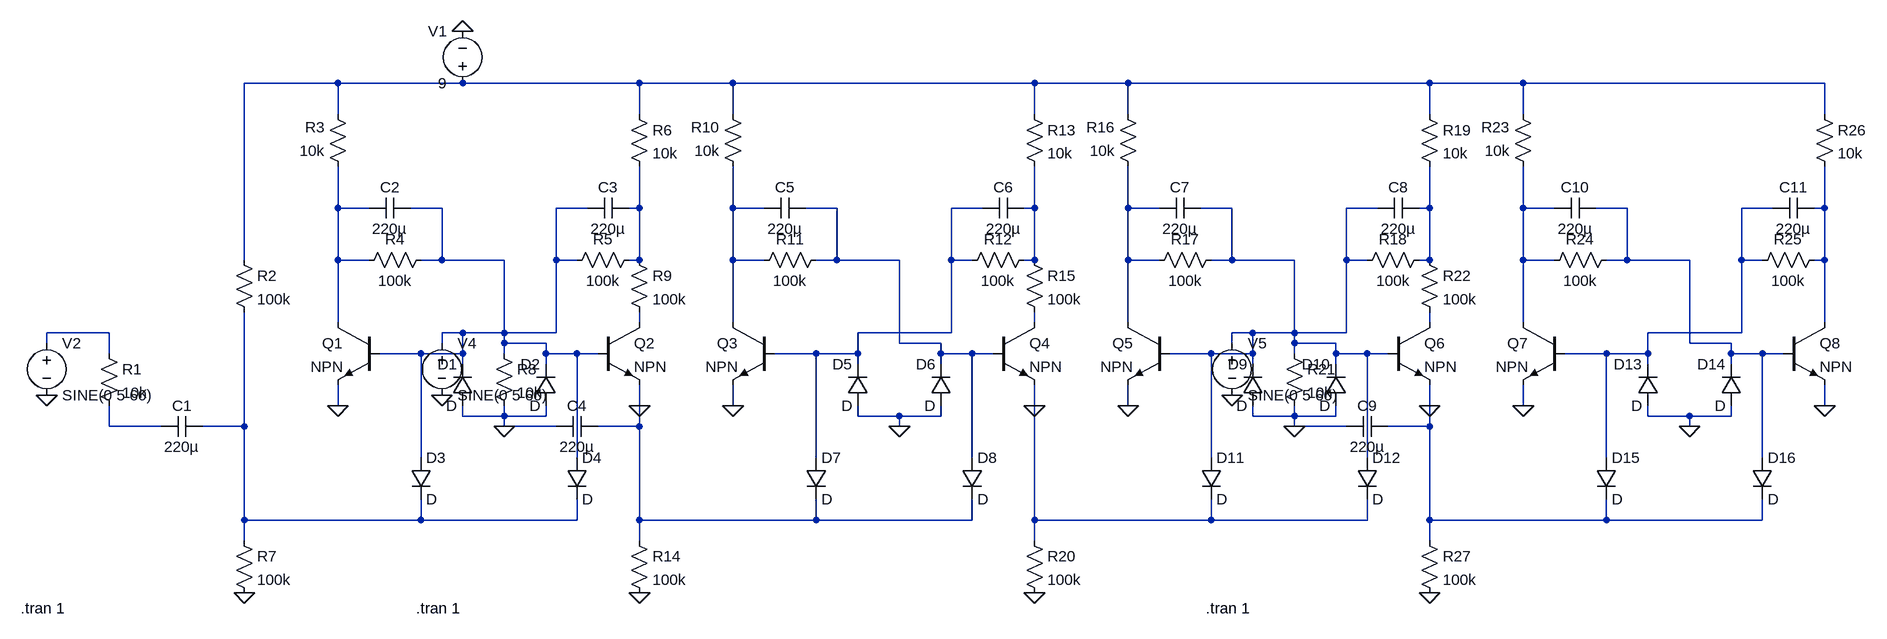
[diagram p0: schematic impedance converter amplifier.asc]
impedance converter amplifier.asc, the LTspice schematic file:
Version 4.1
SHEET 1 2868 680
WIRE 512 -384 368 -384
WIRE 704 -384 512 -384
WIRE 976 -384 704 -384
WIRE 1120 -384 976 -384
WIRE 1584 -384 1120 -384
WIRE 1728 -384 1584 -384
WIRE 2192 -384 1728 -384
WIRE 2336 -384 2192 -384
WIRE 2800 -384 2336 -384
WIRE 512 -336 512 -384
WIRE 976 -336 976 -384
WIRE 1120 -336 1120 -384
WIRE 1584 -336 1584 -384
WIRE 1728 -336 1728 -384
WIRE 2192 -336 2192 -384
WIRE 2336 -336 2336 -384
WIRE 2800 -336 2800 -384
WIRE 512 -192 512 -256
WIRE 560 -192 512 -192
WIRE 672 -192 624 -192
WIRE 896 -192 848 -192
WIRE 976 -192 976 -256
WIRE 976 -192 960 -192
WIRE 1120 -192 1120 -256
WIRE 1168 -192 1120 -192
WIRE 1280 -192 1232 -192
WIRE 1504 -192 1456 -192
WIRE 1584 -192 1584 -256
WIRE 1584 -192 1568 -192
WIRE 1728 -192 1728 -256
WIRE 1776 -192 1728 -192
WIRE 1888 -192 1840 -192
WIRE 2112 -192 2064 -192
WIRE 2192 -192 2192 -256
WIRE 2192 -192 2176 -192
WIRE 2336 -192 2336 -256
WIRE 2384 -192 2336 -192
WIRE 2496 -192 2448 -192
WIRE 2720 -192 2672 -192
WIRE 2800 -192 2800 -256
WIRE 2800 -192 2784 -192
WIRE 368 -112 368 -384
WIRE 512 -112 512 -192
WIRE 560 -112 512 -112
WIRE 672 -112 672 -192
WIRE 672 -112 640 -112
WIRE 768 -112 672 -112
WIRE 848 -112 848 -192
WIRE 880 -112 848 -112
WIRE 976 -112 976 -192
WIRE 976 -112 960 -112
WIRE 1120 -112 1120 -192
WIRE 1168 -112 1120 -112
WIRE 1280 -112 1280 -192
WIRE 1280 -112 1248 -112
WIRE 1376 -112 1280 -112
WIRE 1456 -112 1456 -192
WIRE 1488 -112 1456 -112
WIRE 1584 -112 1584 -192
WIRE 1584 -112 1568 -112
WIRE 1728 -112 1728 -192
WIRE 1776 -112 1728 -112
WIRE 1888 -112 1888 -192
WIRE 1888 -112 1856 -112
WIRE 1984 -112 1888 -112
WIRE 2064 -112 2064 -192
WIRE 2096 -112 2064 -112
WIRE 2192 -112 2192 -192
WIRE 2192 -112 2176 -112
WIRE 2336 -112 2336 -192
WIRE 2384 -112 2336 -112
WIRE 2496 -112 2496 -192
WIRE 2496 -112 2464 -112
WIRE 2592 -112 2496 -112
WIRE 2672 -112 2672 -192
WIRE 2704 -112 2672 -112
WIRE 2800 -112 2800 -192
WIRE 2800 -112 2784 -112
WIRE 512 -16 512 -112
WIRE 976 -16 976 -32
WIRE 1120 -16 1120 -112
WIRE 1584 -16 1584 -32
WIRE 1728 -16 1728 -112
WIRE 2192 -16 2192 -32
WIRE 2336 -16 2336 -112
WIRE 2800 -16 2800 -112
WIRE 160 0 64 0
WIRE 704 0 672 0
WIRE 768 0 768 -112
WIRE 768 0 704 0
WIRE 848 0 848 -112
WIRE 848 0 768 0
WIRE 1456 0 1456 -112
WIRE 1456 0 1312 0
WIRE 1920 0 1888 0
WIRE 1984 0 1984 -112
WIRE 1984 0 1920 0
WIRE 2064 0 2064 -112
WIRE 2064 0 1984 0
WIRE 2672 0 2672 -112
WIRE 2672 0 2528 0
WIRE 64 16 64 0
WIRE 672 16 672 0
WIRE 768 16 768 0
WIRE 832 16 768 16
WIRE 1376 16 1376 -112
WIRE 1440 16 1376 16
WIRE 1888 16 1888 0
WIRE 1984 16 1984 0
WIRE 2048 16 1984 16
WIRE 2592 16 2592 -112
WIRE 2656 16 2592 16
WIRE 160 32 160 0
WIRE 640 32 576 32
WIRE 704 32 704 0
WIRE 704 32 640 32
WIRE 768 32 768 16
WIRE 832 32 832 16
WIRE 880 32 832 32
WIRE 912 32 880 32
WIRE 1248 32 1184 32
WIRE 1312 32 1312 0
WIRE 1312 32 1248 32
WIRE 1440 32 1440 16
WIRE 1488 32 1440 32
WIRE 1520 32 1488 32
WIRE 1856 32 1792 32
WIRE 1920 32 1920 0
WIRE 1920 32 1856 32
WIRE 1984 32 1984 16
WIRE 2048 32 2048 16
WIRE 2096 32 2048 32
WIRE 2128 32 2096 32
WIRE 2464 32 2400 32
WIRE 2528 32 2528 0
WIRE 2528 32 2464 32
WIRE 2656 32 2656 16
WIRE 2704 32 2656 32
WIRE 2736 32 2704 32
WIRE 704 48 704 32
WIRE 832 48 832 32
WIRE 1312 48 1312 32
WIRE 1440 48 1440 32
WIRE 1920 48 1920 32
WIRE 2048 48 2048 32
WIRE 2528 48 2528 32
WIRE 2656 48 2656 32
WIRE 512 112 512 80
WIRE 976 112 976 80
WIRE 1120 112 1120 80
WIRE 1584 112 1584 80
WIRE 1728 112 1728 80
WIRE 2192 112 2192 80
WIRE 2336 112 2336 80
WIRE 2800 112 2800 80
WIRE 704 128 704 112
WIRE 768 128 768 112
WIRE 768 128 704 128
WIRE 832 128 832 112
WIRE 832 128 768 128
WIRE 1312 128 1312 112
WIRE 1376 128 1312 128
WIRE 1440 128 1440 112
WIRE 1440 128 1376 128
WIRE 1920 128 1920 112
WIRE 1984 128 1984 112
WIRE 1984 128 1920 128
WIRE 2048 128 2048 112
WIRE 2048 128 1984 128
WIRE 2528 128 2528 112
WIRE 2592 128 2528 128
WIRE 2656 128 2656 112
WIRE 2656 128 2592 128
WIRE 160 144 160 112
WIRE 240 144 160 144
WIRE 368 144 368 -32
WIRE 368 144 304 144
WIRE 768 144 768 128
WIRE 848 144 768 144
WIRE 976 144 976 112
WIRE 976 144 912 144
WIRE 1376 144 1376 128
WIRE 1984 144 1984 128
WIRE 2064 144 1984 144
WIRE 2192 144 2192 112
WIRE 2192 144 2128 144
WIRE 2592 144 2592 128
WIRE 640 192 640 32
WIRE 880 192 880 32
WIRE 1248 192 1248 32
WIRE 1488 192 1488 32
WIRE 1856 192 1856 32
WIRE 2096 192 2096 32
WIRE 2464 192 2464 32
WIRE 2704 192 2704 32
WIRE 368 288 368 144
WIRE 640 288 640 256
WIRE 640 288 368 288
WIRE 880 288 880 256
WIRE 880 288 640 288
WIRE 976 288 976 144
WIRE 1248 288 1248 256
WIRE 1248 288 976 288
WIRE 1488 288 1488 256
WIRE 1488 288 1248 288
WIRE 1584 288 1584 112
WIRE 1856 288 1856 256
WIRE 1856 288 1584 288
WIRE 2096 288 2096 256
WIRE 2096 288 1856 288
WIRE 2192 288 2192 144
WIRE 2464 288 2464 256
WIRE 2464 288 2192 288
WIRE 2704 288 2704 256
WIRE 2704 288 2464 288
WIRE 368 320 368 288
WIRE 976 320 976 288
WIRE 1584 320 1584 288
WIRE 2192 320 2192 288
FLAG 768 144 0
FLAG 368 400 0
FLAG 512 112 0
FLAG 976 112 0
FLAG 704 -464 0
FLAG 64 96 0
FLAG 1376 144 0
FLAG 976 400 0
FLAG 1120 112 0
FLAG 1584 112 0
FLAG 672 96 0
FLAG 1984 144 0
FLAG 1584 400 0
FLAG 1728 112 0
FLAG 2192 112 0
FLAG 2592 144 0
FLAG 2192 400 0
FLAG 2336 112 0
FLAG 2800 112 0
FLAG 1888 96 0
SYMBOL res 144 16 R0
SYMATTR InstName R1
SYMATTR Value 10k
SYMBOL cap 304 128 R90
WINDOW 0 0 32 VBottom 2
WINDOW 3 32 32 VTop 2
SYMATTR InstName C1
SYMATTR Value 220µ
SYMBOL res 352 -128 R0
SYMATTR InstName R2
SYMATTR Value 100k
SYMBOL res 528 -240 R180
WINDOW 0 36 76 Left 2
WINDOW 3 36 40 Left 2
SYMATTR InstName R3
SYMATTR Value 10k
SYMBOL res 544 -96 R270
WINDOW 0 32 56 VTop 2
WINDOW 3 0 56 VBottom 2
SYMATTR InstName R4
SYMATTR Value 100k
SYMBOL cap 624 -208 R90
WINDOW 0 0 32 VBottom 2
WINDOW 3 32 32 VTop 2
SYMATTR InstName C2
SYMATTR Value 220µ
SYMBOL npn 576 -16 M0
SYMATTR InstName Q1
SYMBOL npn 912 -16 R0
SYMATTR InstName Q2
SYMBOL cap 960 -208 R90
WINDOW 0 0 32 VBottom 2
WINDOW 3 32 32 VTop 2
SYMATTR InstName C3
SYMATTR Value 220µ
SYMBOL res 976 -128 R90
WINDOW 0 0 56 VBottom 2
WINDOW 3 32 56 VTop 2
SYMATTR InstName R5
SYMATTR Value 100k
SYMBOL res 960 -352 R0
SYMATTR InstName R6
SYMATTR Value 10k
SYMBOL diode 720 112 R180
WINDOW 0 24 64 Left 2
WINDOW 3 24 0 Left 2
SYMATTR InstName D1
SYMBOL diode 848 112 R180
WINDOW 0 24 64 Left 2
WINDOW 3 24 0 Left 2
SYMATTR InstName D2
SYMBOL diode 624 192 R0
SYMATTR InstName D3
SYMBOL diode 864 192 R0
SYMATTR InstName D4
SYMBOL res 352 304 R0
SYMATTR InstName R7
SYMATTR Value 100k
SYMBOL voltage 704 -368 R180
WINDOW 0 24 96 Left 2
WINDOW 3 24 16 Left 2
SYMATTR InstName V1
SYMATTR Value 9
SYMBOL voltage 64 0 R0
WINDOW 123 0 0 Left 0
WINDOW 39 0 0 Left 0
SYMATTR InstName V2
SYMATTR Value SINE(0 5 60)
SYMBOL res 752 16 R0
SYMATTR InstName R8
SYMATTR Value 10k
SYMBOL cap 912 128 R90
WINDOW 0 0 32 VBottom 2
WINDOW 3 32 32 VTop 2
SYMATTR InstName C4
SYMATTR Value 220µ
SYMBOL res 960 -128 R0
SYMATTR InstName R9
SYMATTR Value 100k
SYMBOL res 1136 -240 R180
WINDOW 0 36 76 Left 2
WINDOW 3 36 40 Left 2
SYMATTR InstName R10
SYMATTR Value 10k
SYMBOL res 1152 -96 R270
WINDOW 0 32 56 VTop 2
WINDOW 3 0 56 VBottom 2
SYMATTR InstName R11
SYMATTR Value 100k
SYMBOL cap 1232 -208 R90
WINDOW 0 0 32 VBottom 2
WINDOW 3 32 32 VTop 2
SYMATTR InstName C5
SYMATTR Value 220µ
SYMBOL npn 1184 -16 M0
SYMATTR InstName Q3
SYMBOL npn 1520 -16 R0
SYMATTR InstName Q4
SYMBOL cap 1568 -208 R90
WINDOW 0 0 32 VBottom 2
WINDOW 3 32 32 VTop 2
SYMATTR InstName C6
SYMATTR Value 220µ
SYMBOL res 1584 -128 R90
WINDOW 0 0 56 VBottom 2
WINDOW 3 32 56 VTop 2
SYMATTR InstName R12
SYMATTR Value 100k
SYMBOL res 1568 -352 R0
SYMATTR InstName R13
SYMATTR Value 10k
SYMBOL diode 1328 112 R180
WINDOW 0 24 64 Left 2
WINDOW 3 24 0 Left 2
SYMATTR InstName D5
SYMBOL diode 1456 112 R180
WINDOW 0 24 64 Left 2
WINDOW 3 24 0 Left 2
SYMATTR InstName D6
SYMBOL diode 1232 192 R0
SYMATTR InstName D7
SYMBOL diode 1472 192 R0
SYMATTR InstName D8
SYMBOL res 960 304 R0
SYMATTR InstName R14
SYMATTR Value 100k
SYMBOL voltage 672 0 R0
WINDOW 123 0 0 Left 0
WINDOW 39 0 0 Left 0
SYMATTR InstName V4
SYMATTR Value SINE(0 5 60)
SYMBOL res 1568 -128 R0
SYMATTR InstName R15
SYMATTR Value 100k
SYMBOL res 1744 -240 R180
WINDOW 0 36 76 Left 2
WINDOW 3 36 40 Left 2
SYMATTR InstName R16
SYMATTR Value 10k
SYMBOL res 1760 -96 R270
WINDOW 0 32 56 VTop 2
WINDOW 3 0 56 VBottom 2
SYMATTR InstName R17
SYMATTR Value 100k
SYMBOL cap 1840 -208 R90
WINDOW 0 0 32 VBottom 2
WINDOW 3 32 32 VTop 2
SYMATTR InstName C7
SYMATTR Value 220µ
SYMBOL npn 1792 -16 M0
SYMATTR InstName Q5
SYMBOL npn 2128 -16 R0
SYMATTR InstName Q6
SYMBOL cap 2176 -208 R90
WINDOW 0 0 32 VBottom 2
WINDOW 3 32 32 VTop 2
SYMATTR InstName C8
SYMATTR Value 220µ
SYMBOL res 2192 -128 R90
WINDOW 0 0 56 VBottom 2
WINDOW 3 32 56 VTop 2
SYMATTR InstName R18
SYMATTR Value 100k
SYMBOL res 2176 -352 R0
SYMATTR InstName R19
SYMATTR Value 10k
SYMBOL diode 1936 112 R180
WINDOW 0 24 64 Left 2
WINDOW 3 24 0 Left 2
SYMATTR InstName D9
SYMBOL diode 2064 112 R180
WINDOW 0 24 64 Left 2
WINDOW 3 24 0 Left 2
SYMATTR InstName D10
SYMBOL diode 1840 192 R0
SYMATTR InstName D11
SYMBOL diode 2080 192 R0
SYMATTR InstName D12
SYMBOL res 1568 304 R0
SYMATTR InstName R20
SYMATTR Value 100k
SYMBOL res 1968 16 R0
SYMATTR InstName R21
SYMATTR Value 10k
SYMBOL cap 2128 128 R90
WINDOW 0 0 32 VBottom 2
WINDOW 3 32 32 VTop 2
SYMATTR InstName C9
SYMATTR Value 220µ
SYMBOL res 2176 -128 R0
SYMATTR InstName R22
SYMATTR Value 100k
SYMBOL res 2352 -240 R180
WINDOW 0 36 76 Left 2
WINDOW 3 36 40 Left 2
SYMATTR InstName R23
SYMATTR Value 10k
SYMBOL res 2368 -96 R270
WINDOW 0 32 56 VTop 2
WINDOW 3 0 56 VBottom 2
SYMATTR InstName R24
SYMATTR Value 100k
SYMBOL cap 2448 -208 R90
WINDOW 0 0 32 VBottom 2
WINDOW 3 32 32 VTop 2
SYMATTR InstName C10
SYMATTR Value 220µ
SYMBOL npn 2400 -16 M0
SYMATTR InstName Q7
SYMBOL npn 2736 -16 R0
SYMATTR InstName Q8
SYMBOL cap 2784 -208 R90
WINDOW 0 0 32 VBottom 2
WINDOW 3 32 32 VTop 2
SYMATTR InstName C11
SYMATTR Value 220µ
SYMBOL res 2800 -128 R90
WINDOW 0 0 56 VBottom 2
WINDOW 3 32 56 VTop 2
SYMATTR InstName R25
SYMATTR Value 100k
SYMBOL res 2784 -352 R0
SYMATTR InstName R26
SYMATTR Value 10k
SYMBOL diode 2544 112 R180
WINDOW 0 24 64 Left 2
WINDOW 3 24 0 Left 2
SYMATTR InstName D13
SYMBOL diode 2672 112 R180
WINDOW 0 24 64 Left 2
WINDOW 3 24 0 Left 2
SYMATTR InstName D14
SYMBOL diode 2448 192 R0
SYMATTR InstName D15
SYMBOL diode 2688 192 R0
SYMATTR InstName D16
SYMBOL res 2176 304 R0
SYMATTR InstName R27
SYMATTR Value 100k
SYMBOL voltage 1888 0 R0
WINDOW 123 0 0 Left 0
WINDOW 39 0 0 Left 0
SYMATTR InstName V5
SYMATTR Value SINE(0 5 60)
TEXT 24 424 Left 2 !.tran 1
TEXT 632 424 Left 2 !.tran 1
TEXT 1848 424 Left 2 !.tran 1

The netlist it stands for:
* impedance converter amplifier.asc
R1 N019 N020 10k
C1 N021 N020 220µ
R2 N001 N021 100k
R3 N002 N001 10k
R4 N002 N003 100k
C2 N003 N002 220µ
Q1 N002 N003 0 0 NPN
Q2 N016 N003 0 0 NPN
C3 N004 N003 220µ
R5 N004 N003 100k
R6 N001 N004 10k
D1 0 N003 D
D2 0 N003 D
D3 N003 N021 D
D4 N003 N021 D
R7 N021 0 100k
V1 N001 0 9
V2 N019 0 SINE(0 5 60)
R8 N003 0 10k
C4 0 0 220µ
R9 N004 N016 100k
R10 N005 N001 10k
R11 N005 N006 100k
C5 N006 N005 220µ
Q3 N005 N007 0 0 NPN
Q4 N017 N006 0 0 NPN
C6 N008 N007 220µ
R12 N008 N007 100k
R13 N001 N008 10k
D5 0 N007 D
D6 0 N006 D
D7 N007 0 D
D8 N006 0 D
R14 0 0 100k
V4 N003 0 SINE(0 5 60)
R15 N008 N017 100k
R16 N009 N001 10k
R17 N009 N010 100k
C7 N010 N009 220µ
Q5 N009 N010 0 0 NPN
Q6 N018 N010 0 0 NPN
C8 N011 N010 220µ
R18 N011 N010 100k
R19 N001 N011 10k
D9 0 N010 D
D10 0 N010 D
D11 N010 0 D
D12 N010 0 D
R20 0 0 100k
R21 N010 0 10k
C9 0 0 220µ
R22 N011 N018 100k
R23 N012 N001 10k
R24 N012 N013 100k
C10 N013 N012 220µ
Q7 N012 N014 0 0 NPN
Q8 N015 N013 0 0 NPN
C11 N015 N014 220µ
R25 N015 N014 100k
R26 N001 N015 10k
D13 0 N014 D
D14 0 N013 D
D15 N014 0 D
D16 N013 0 D
R27 0 0 100k
V5 N010 0 SINE(0 5 60)
.model D D
.lib standard.dio
.model NPN NPN
.model PNP PNP
.lib standard.bjt
.tran 1
.tran 1
.tran 1
.backanno
.end